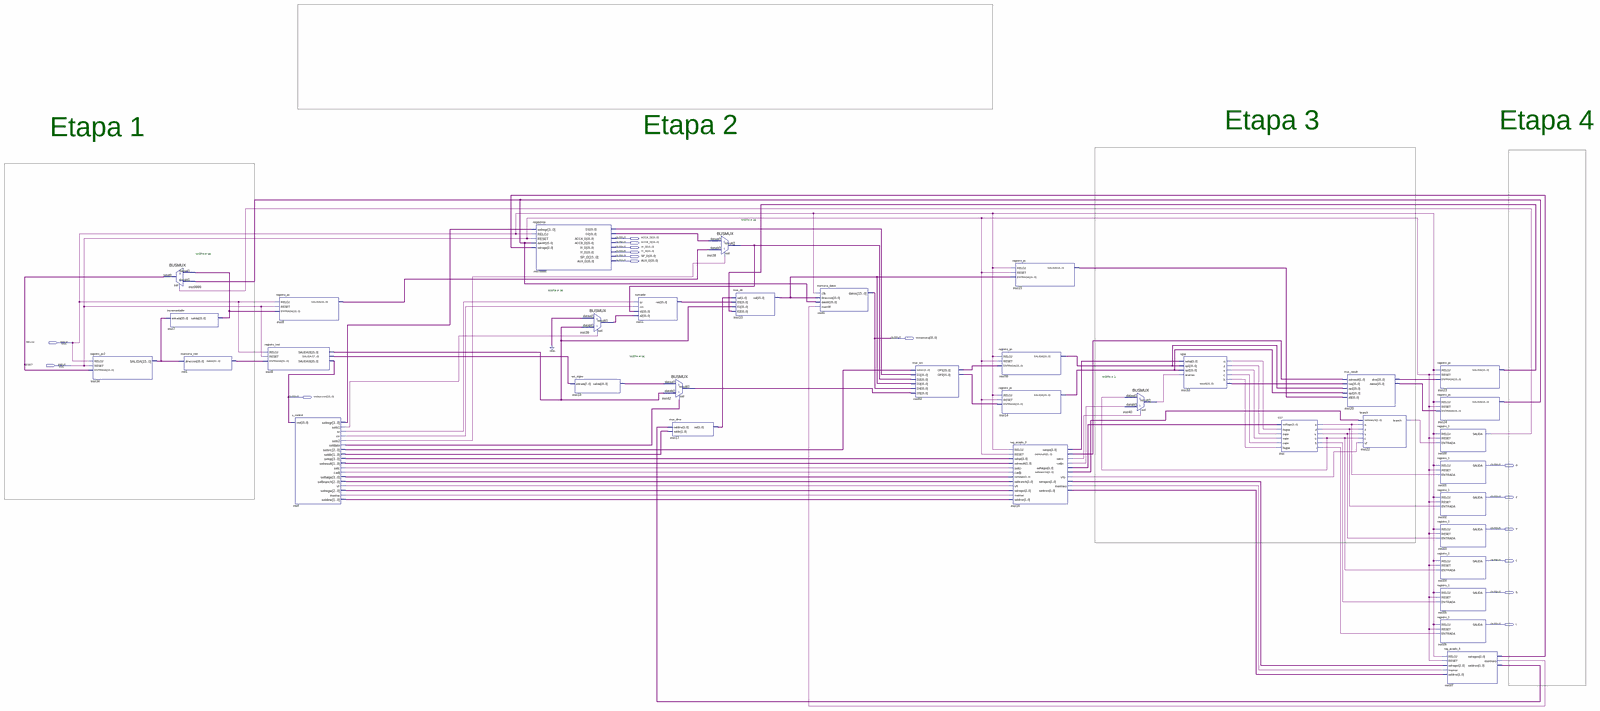
[diagram p0: schematic sheet, whole]
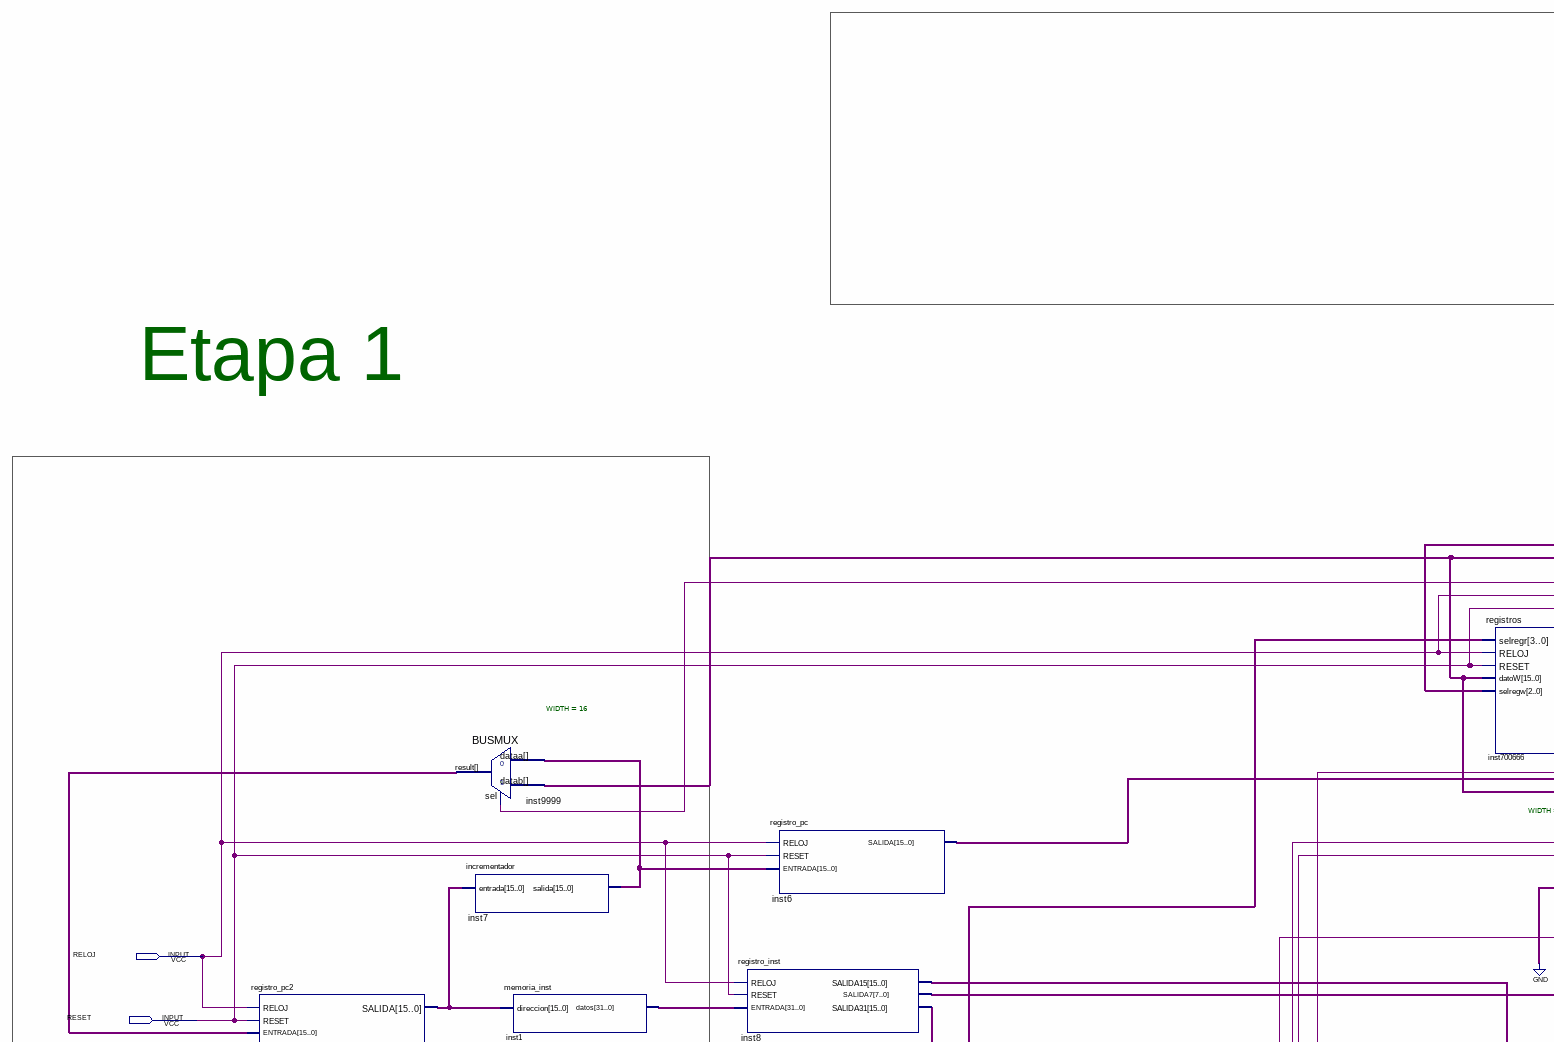
[diagram p1: schematic sheet, upper left part]
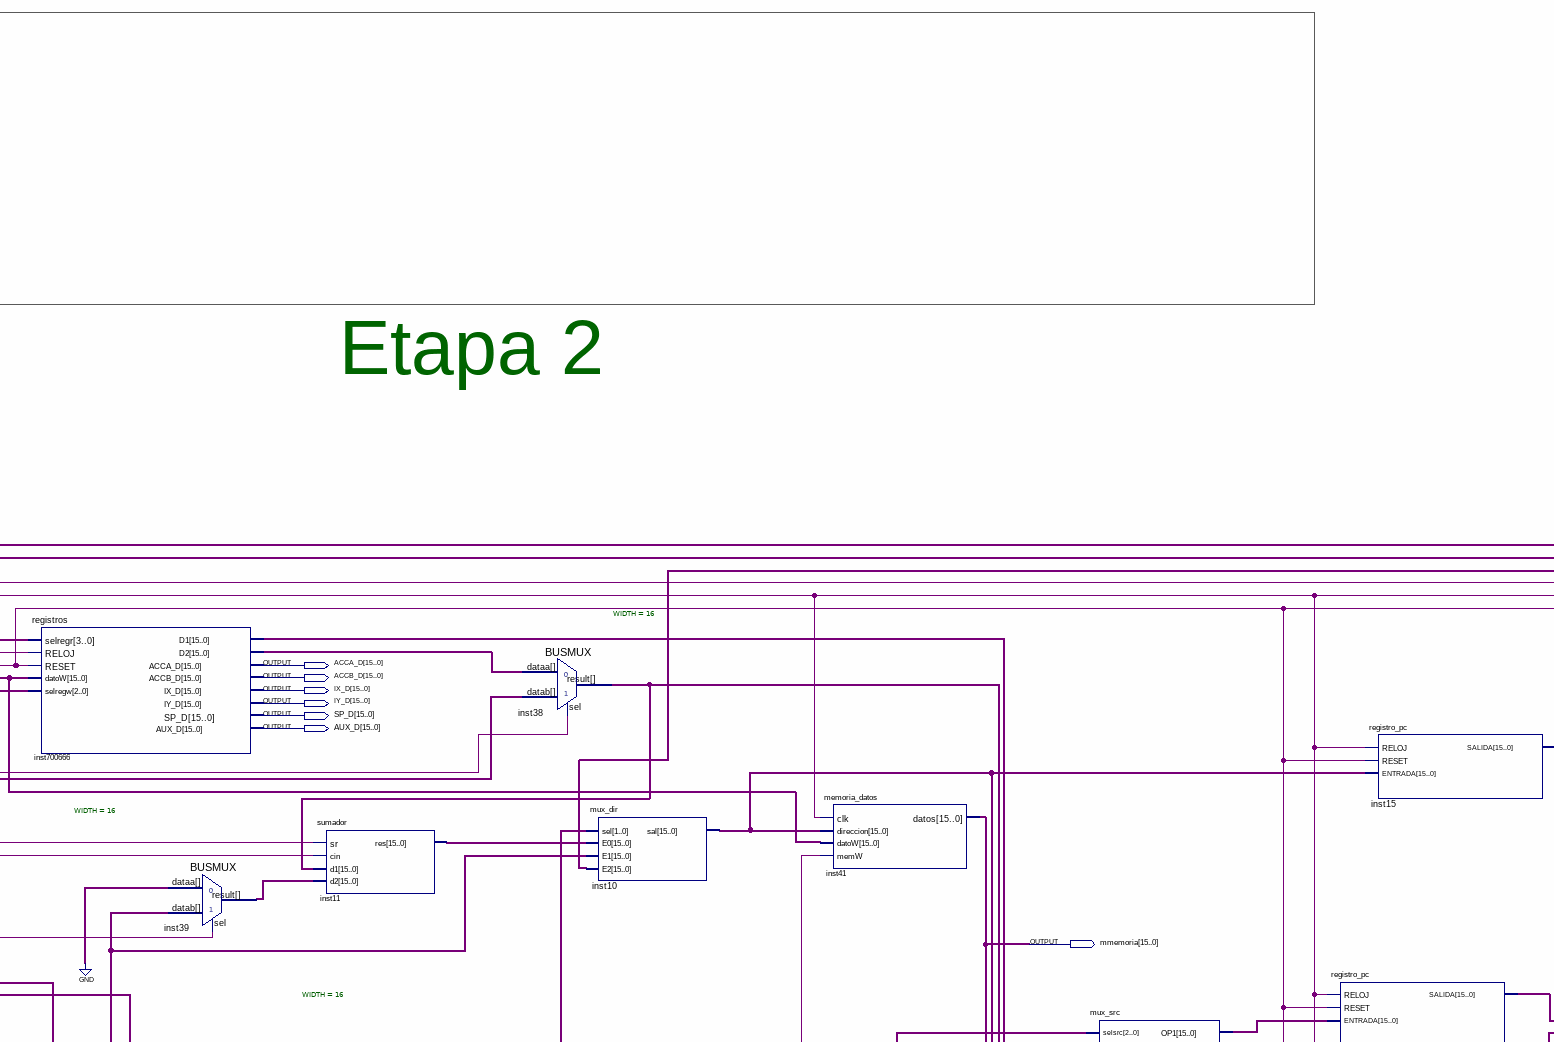
[diagram p2: schematic sheet, upper centre part]
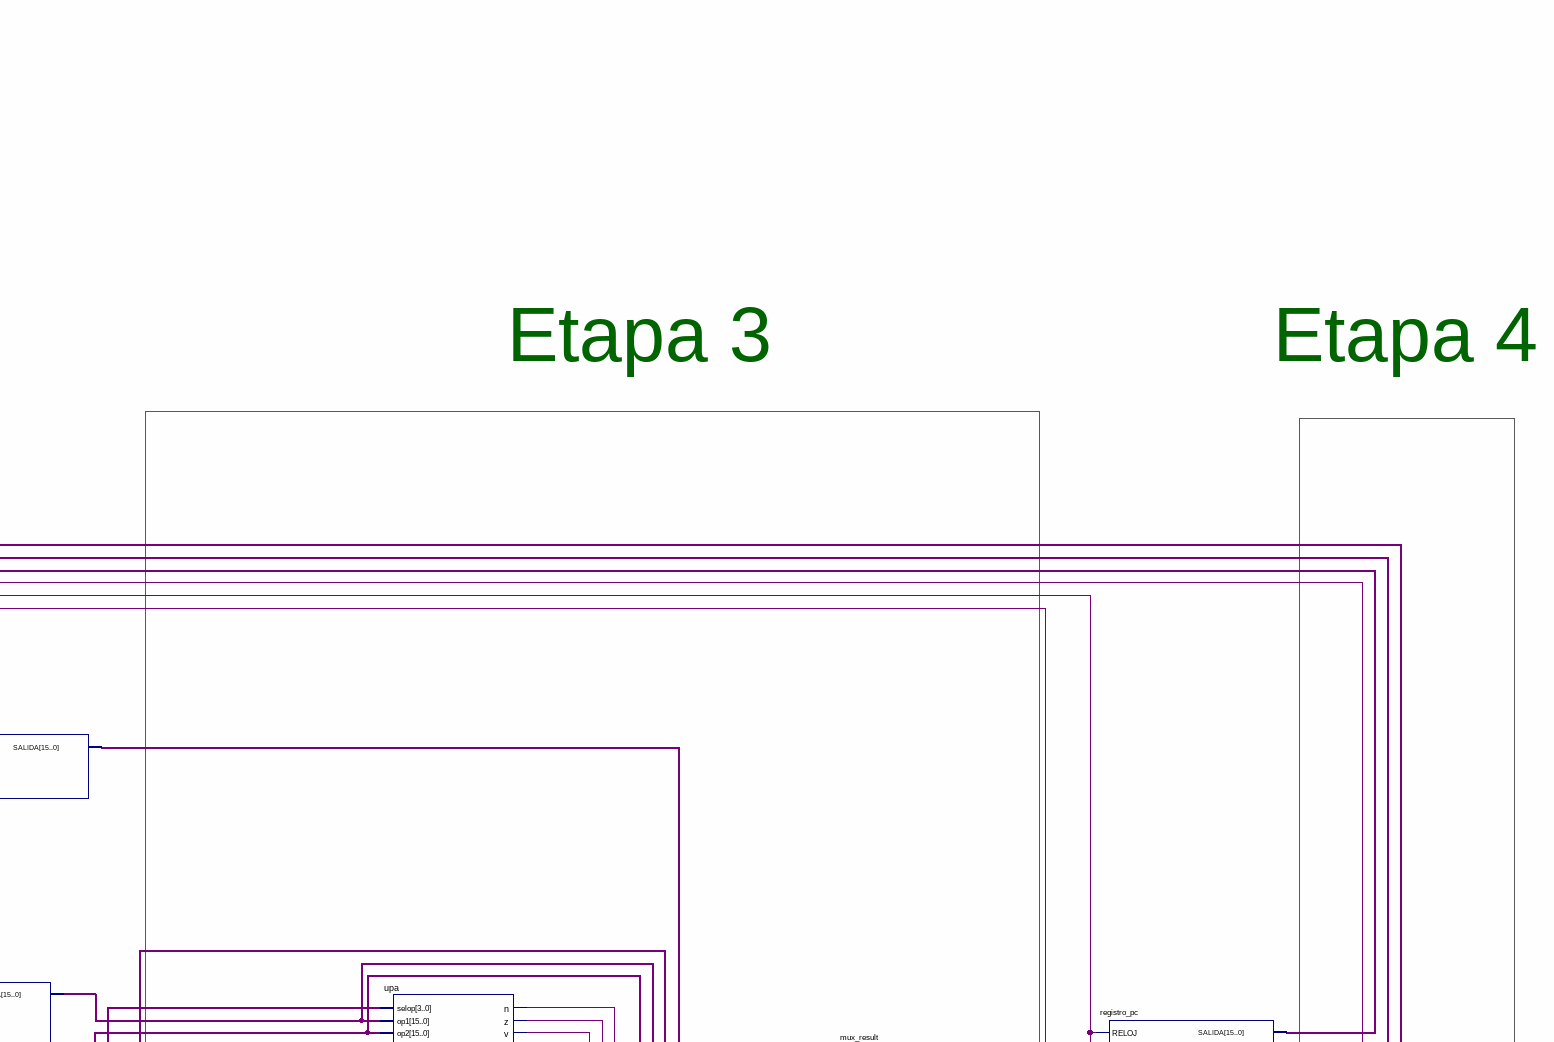
[diagram p3: schematic sheet, upper right part]
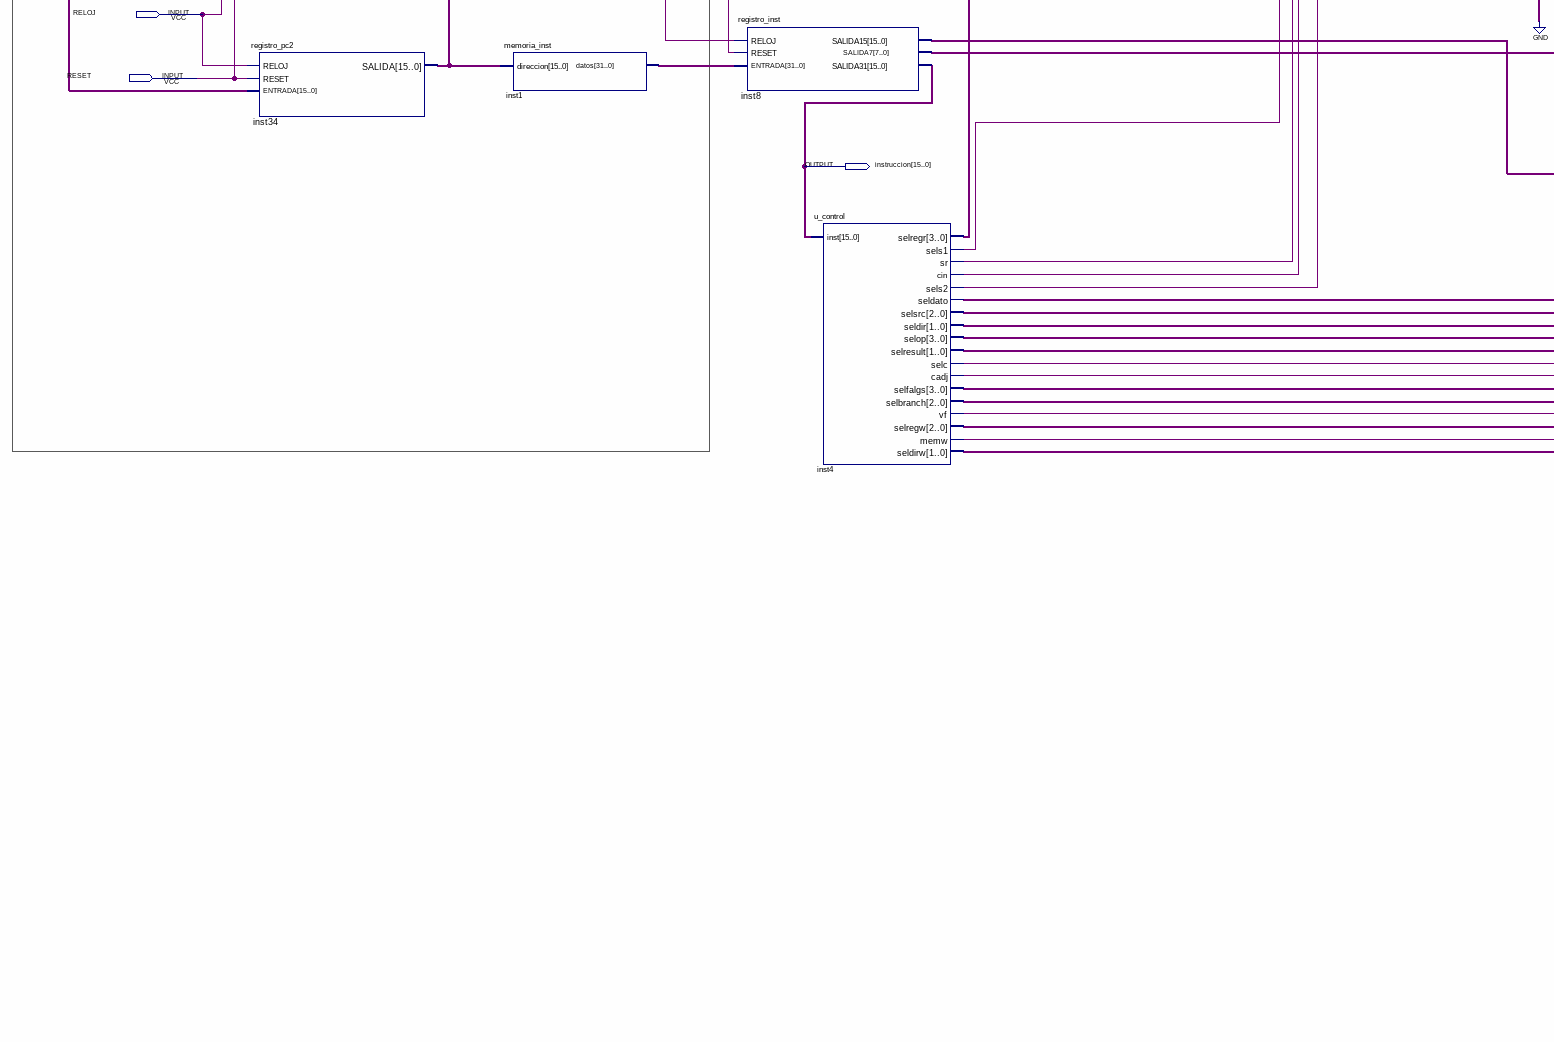
[diagram p4: schematic sheet, lower left part]
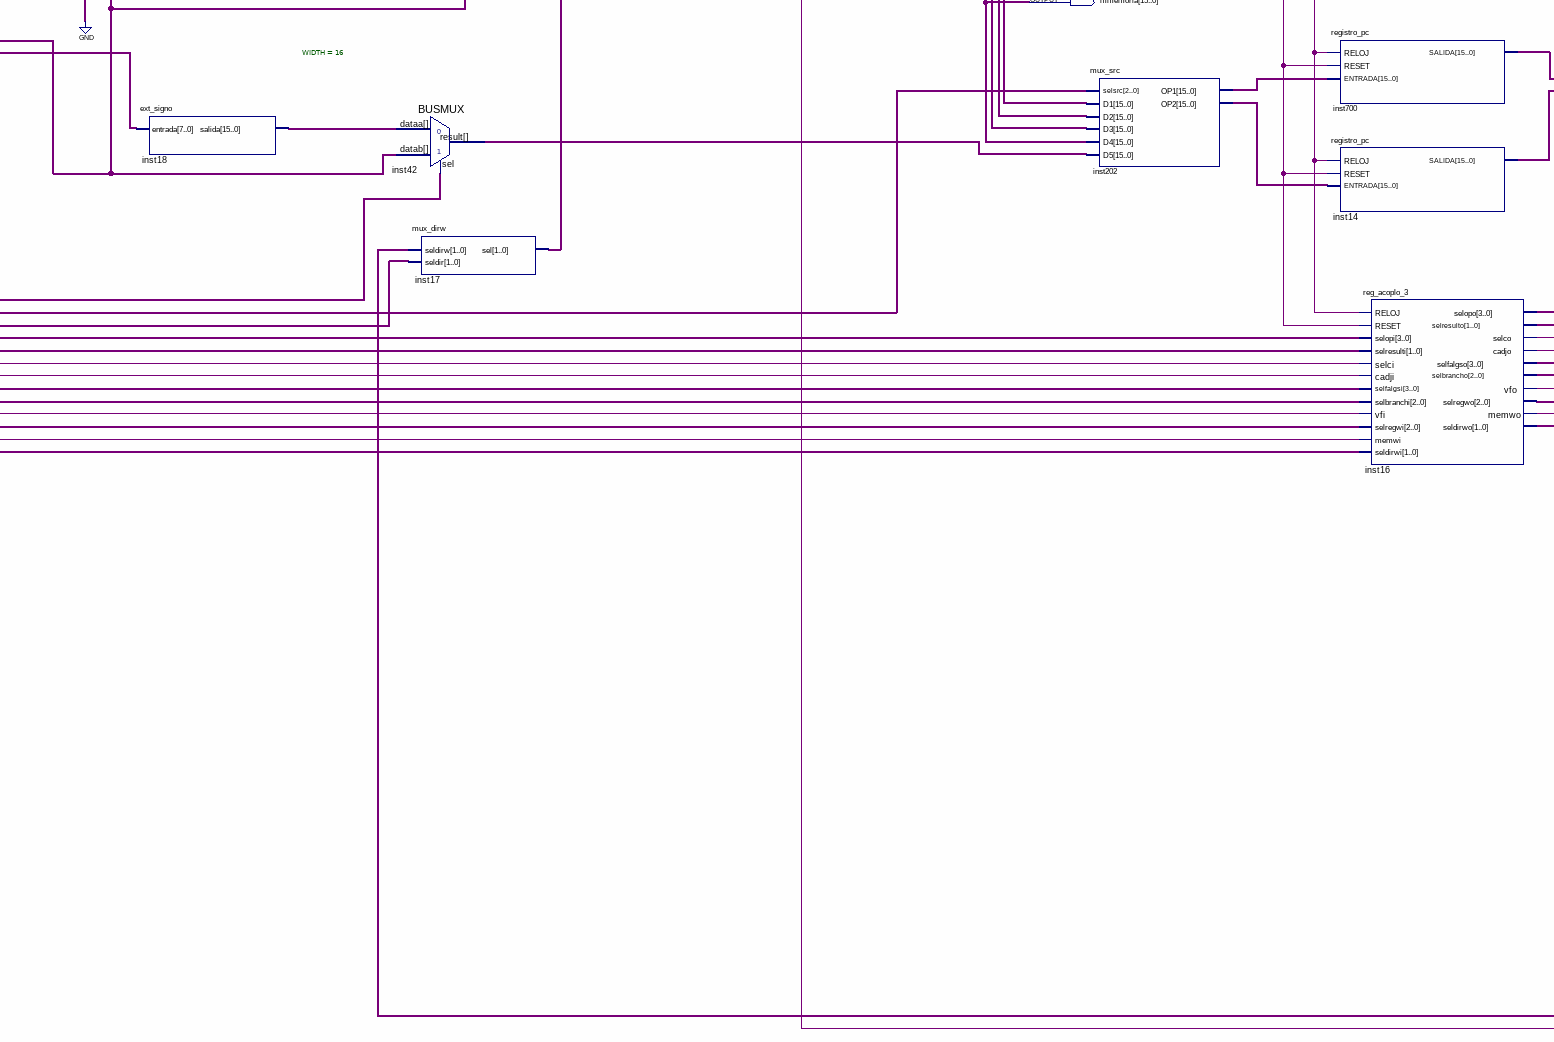
[diagram p5: schematic sheet, lower centre part]
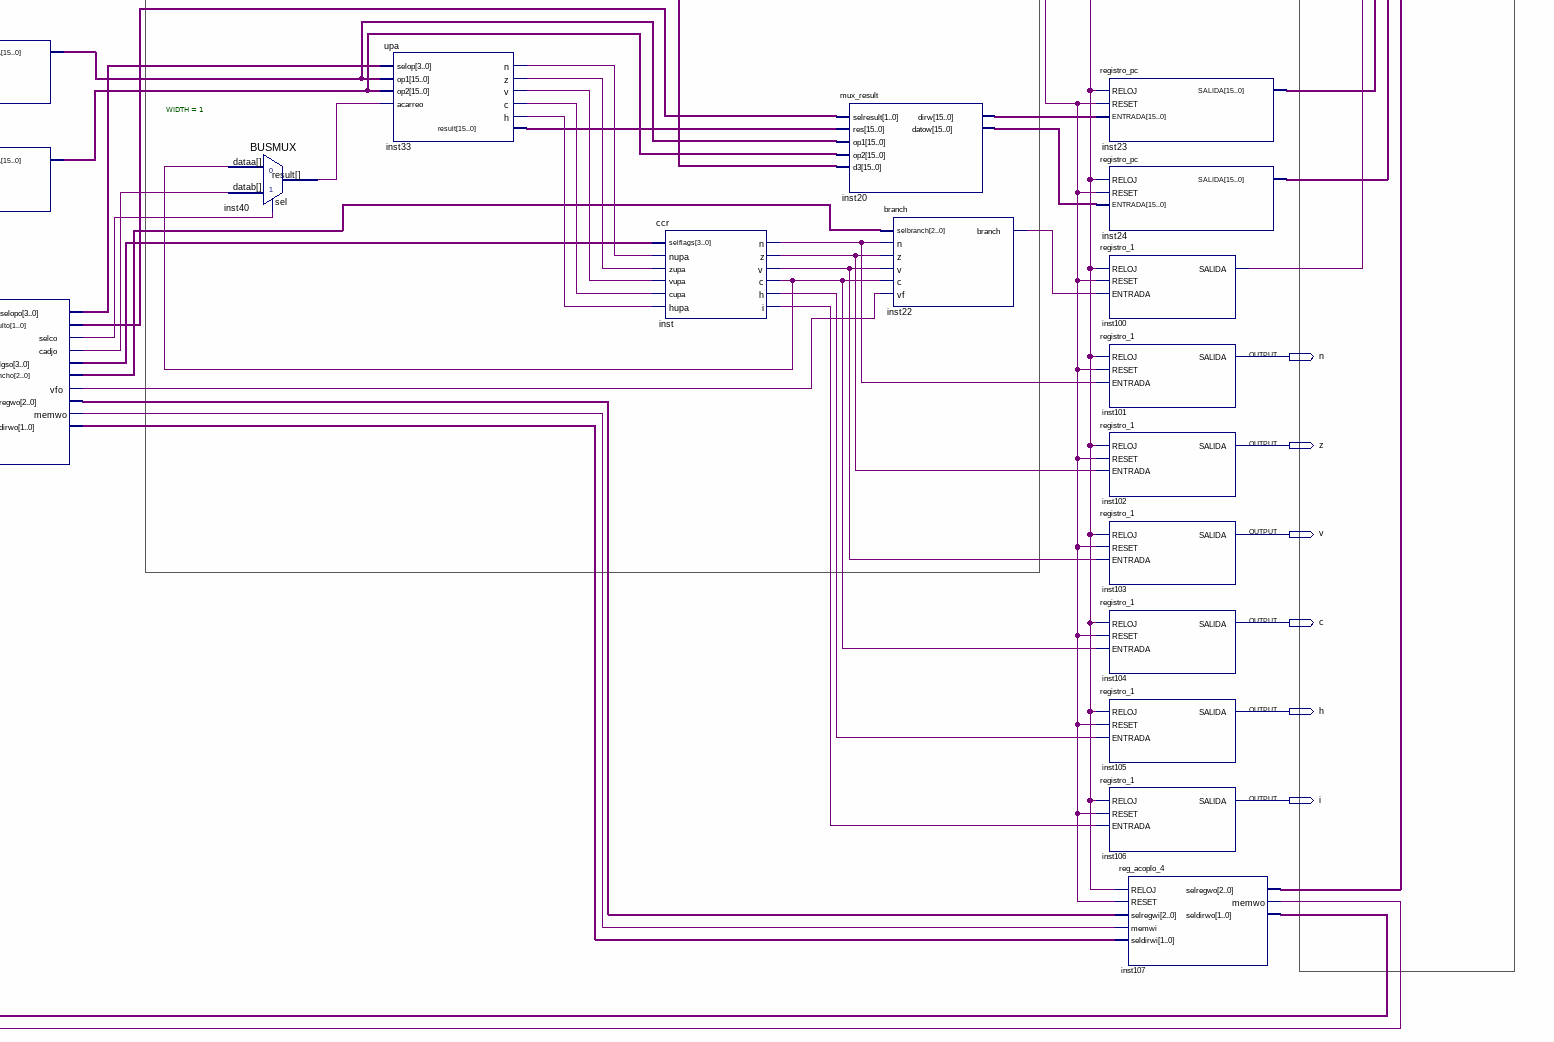
[diagram p6: schematic sheet, lower right part]
// Quartus schematic pipeline.bdf as structural Verilog: 36 symbols, 16 pins
module pipeline (
  input  RELOJ,
  input  RESET,
  output [15:0] ACCA_D,
  output [15:0] ACCB_D,
  output [15:0] IX_D,
  output [15:0] IY_D,
  output [15:0] SP_D,
  output [15:0] AUX_D,
  output [15:0] mmemoria,
  output [15:0] instruccion,
  output n,
  output z,
  output v,
  output c,
  output h,
  output i
);

  wire inst4_cadj, inst4_cin, inst4_memw, inst4_selc, inst4_seldato, inst4_sels1, inst4_sels2, inst4_sr,
       inst4_vf, inst16_cadjo, inst16_memwo, inst16_selco, inst16_vfo, inst22_branch, inst33_c, inst33_h,
       inst33_n, inst33_v, inst33_z, inst40_result, inst100_salida, inst107_memwo, inst_c, inst_h, inst_i,
       inst_n, inst_v, inst_z;
  wire [1:0] inst4_seldir, inst4_seldirw, inst4_selresult, inst16_seldirwo, inst16_selresulto, inst17_sel,
       inst107_seldirwo;
  wire [2:0] inst4_selbranch, inst4_selregw, inst4_selsrc, inst16_selbrancho, inst16_selregwo,
       inst107_selregwo;
  wire [3:0] inst4_selfalgs, inst4_selop, inst4_selregr, inst16_selfalgso, inst16_selopo;
  wire [7:0] inst8_salida7;
  wire [15:0] inst6_salida, inst7_salida, inst8_salida15, inst10_sal, inst11_res, inst14_salida,
       inst15_salida, inst18_salida, inst20_datow, inst20_dirw, inst23_salida, inst24_salida, inst33_result,
       inst34_salida, inst38_result, inst39_result, inst42_result, inst202_op1, inst202_op2, inst700_salida,
       inst9999_result, inst700666_d1, inst700666_d2;
  wire [31:0] inst1_datos;

  registro_pc2 inst34 (.RELOJ(RELOJ), .RESET(RESET), .ENTRADA(inst9999_result), .SALIDA(inst34_salida));
  BUSMUX #(.WIDTH(16)) inst9999 (
    .datab(inst24_salida), .sel(inst100_salida), .dataa(inst7_salida), .result(inst9999_result));
  incrementador inst7 (.entrada(inst34_salida), .salida(inst7_salida));
  memoria_inst inst1 (.direccion(inst34_salida), .datos(inst1_datos));
  registro_inst inst8 (
    .RELOJ(RELOJ), .RESET(RESET), .ENTRADA(inst1_datos), .SALIDA15(inst8_salida15), .SALIDA7(inst8_salida7),
    .SALIDA31(instruccion));
  registro_pc inst6 (.RELOJ(RELOJ), .RESET(RESET), .ENTRADA(inst7_salida), .SALIDA(inst6_salida));
  u_control inst4 (
    .inst(instruccion), .selregr(inst4_selregr), .sels1(inst4_sels1), .sr(inst4_sr), .cin(inst4_cin),
    .sels2(inst4_sels2), .seldato(inst4_seldato), .selsrc(inst4_selsrc), .seldir(inst4_seldir),
    .selop(inst4_selop), .selresult(inst4_selresult), .selc(inst4_selc), .cadj(inst4_cadj),
    .selfalgs(inst4_selfalgs), .selbranch(inst4_selbranch), .vf(inst4_vf), .selregw(inst4_selregw),
    .memw(inst4_memw), .seldirw(inst4_seldirw));
  registros inst700666 (
    .selregr(inst4_selregr), .RELOJ(RELOJ), .RESET(RESET), .datoW(inst24_salida), .selregw(inst107_selregwo),
    .D1(inst700666_d1), .D2(inst700666_d2), .ACCA_D(ACCA_D), .ACCB_D(ACCB_D), .IX_D(IX_D), .IY_D(IY_D),
    .SP_D(SP_D), .AUX_D(AUX_D));
  ext_signo inst18 (.entrada(inst8_salida7), .salida(inst18_salida));
  BUSMUX #(.WIDTH(16)) inst39 (.datab(inst8_salida15), .sel(inst4_sels1), .dataa({16{1'b0}}), .result(inst39_result));
  sumador inst11 (.sr(inst4_sr), .cin(inst4_cin), .d1(inst38_result), .d2(inst39_result), .res(inst11_res));
  BUSMUX #(.WIDTH(16)) inst42 (
    .datab(inst8_salida15), .sel(inst4_seldato), .dataa(inst18_salida), .result(inst42_result));
  mux_dirw inst17 (.seldirw(inst107_seldirwo), .seldir(inst4_seldir), .sel(inst17_sel));
  BUSMUX #(.WIDTH(16)) inst38 (.datab(inst6_salida), .sel(inst4_sels2), .dataa(inst700666_d2), .result(inst38_result));
  mux_dir inst10 (.sel(inst17_sel), .E0(inst11_res), .E1(inst8_salida15), .E2(inst23_salida), .sal(inst10_sal));
  memoria_datos inst41 (
    .clk(RELOJ), .direccion(inst10_sal), .datoW(inst24_salida), .memW(inst107_memwo), .datos(mmemoria));
  mux_src inst202 (
    .selsrc(inst4_selsrc), .D1(inst700666_d1), .D2(inst38_result), .D3(inst10_sal), .D4(mmemoria),
    .D5(inst42_result), .OP1(inst202_op1), .OP2(inst202_op2));
  registro_pc inst700 (.RELOJ(RELOJ), .RESET(RESET), .ENTRADA(inst202_op1), .SALIDA(inst700_salida));
  registro_pc inst14 (.RELOJ(RELOJ), .RESET(RESET), .ENTRADA(inst202_op2), .SALIDA(inst14_salida));
  registro_pc inst15 (.RELOJ(RELOJ), .RESET(RESET), .ENTRADA(inst10_sal), .SALIDA(inst15_salida));
  reg_acoplo_3 inst16 (
    .RELOJ(RELOJ), .RESET(RESET), .selopi(inst4_selop), .selresulti(inst4_selresult), .selci(inst4_selc),
    .cadji(inst4_cadj), .selfalgsi(inst4_selfalgs), .selbranchi(inst4_selbranch), .vfi(inst4_vf),
    .selregwi(inst4_selregw), .memwi(inst4_memw), .seldirwi(inst4_seldirw), .selopo(inst16_selopo),
    .selresulto(inst16_selresulto), .selco(inst16_selco), .cadjo(inst16_cadjo), .selfalgso(inst16_selfalgso),
    .selbrancho(inst16_selbrancho), .vfo(inst16_vfo), .selregwo(inst16_selregwo), .memwo(inst16_memwo),
    .seldirwo(inst16_seldirwo));
  BUSMUX #(.WIDTH(1)) inst40 (.datab(inst16_cadjo), .sel(inst16_selco), .dataa(inst_c), .result(inst40_result));
  upa inst33 (
    .selop(inst16_selopo), .op1(inst700_salida), .op2(inst14_salida), .acarreo(inst40_result), .n(inst33_n),
    .z(inst33_z), .v(inst33_v), .c(inst33_c), .h(inst33_h), .result(inst33_result));
  ccr inst (
    .selflags(inst16_selfalgso), .nupa(inst33_n), .zupa(inst33_z), .vupa(inst33_v), .cupa(inst33_c),
    .hupa(inst33_h), .n(inst_n), .z(inst_z), .v(inst_v), .c(inst_c), .h(inst_h), .i(inst_i));
  mux_result inst20 (
    .selresult(inst16_selresulto), .res(inst33_result), .op1(inst700_salida), .op2(inst14_salida),
    .d3(inst15_salida), .dirw(inst20_dirw), .datow(inst20_datow));
  branch inst22 (
    .selbranch(inst16_selbrancho), .n(inst_n), .z(inst_z), .v(inst_v), .c(inst_c), .vf(inst16_vfo),
    .branch(inst22_branch));
  registro_pc inst23 (.RELOJ(RELOJ), .RESET(RESET), .ENTRADA(inst20_dirw), .SALIDA(inst23_salida));
  registro_pc inst24 (.RELOJ(RELOJ), .RESET(RESET), .ENTRADA(inst20_datow), .SALIDA(inst24_salida));
  registro_1 inst100 (.RELOJ(RELOJ), .RESET(RESET), .ENTRADA(inst22_branch), .SALIDA(inst100_salida));
  registro_1 inst101 (.RELOJ(RELOJ), .RESET(RESET), .ENTRADA(inst_n), .SALIDA(n));
  registro_1 inst102 (.RELOJ(RELOJ), .RESET(RESET), .ENTRADA(inst_z), .SALIDA(z));
  registro_1 inst103 (.RELOJ(RELOJ), .RESET(RESET), .ENTRADA(inst_v), .SALIDA(v));
  registro_1 inst104 (.RELOJ(RELOJ), .RESET(RESET), .ENTRADA(inst_c), .SALIDA(c));
  registro_1 inst105 (.RELOJ(RELOJ), .RESET(RESET), .ENTRADA(inst_h), .SALIDA(h));
  registro_1 inst106 (.RELOJ(RELOJ), .RESET(RESET), .ENTRADA(inst_i), .SALIDA(i));
  reg_acoplo_4 inst107 (
    .RELOJ(RELOJ), .RESET(RESET), .selregwi(inst16_selregwo), .memwi(inst16_memwo),
    .seldirwi(inst16_seldirwo), .selregwo(inst107_selregwo), .memwo(inst107_memwo),
    .seldirwo(inst107_seldirwo));

  // Notes on the sheet:
  //   Etapa 3
  //   Etapa 4
  //   Etapa 2
  //   Etapa 1
endmodule
